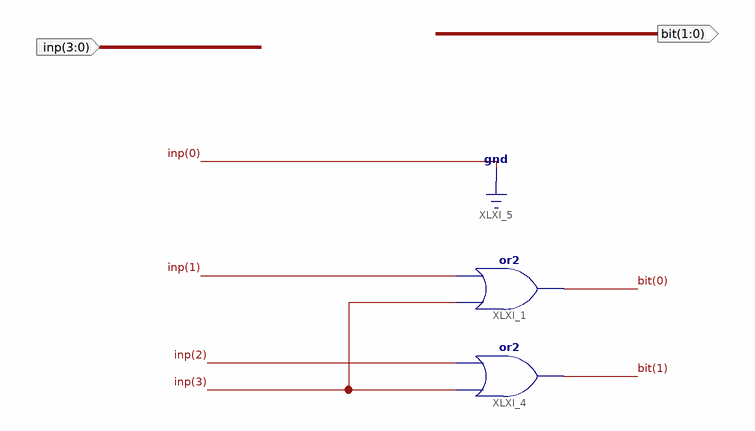
[diagram p0: schematic sheet 1]
// Xilinx ISE schematic EncodeGate.sch (spartan6) as structural Verilog: 2 symbols, 2 ports
module EncodeGate (
  input  [3:0] inp,
  output [1:0] \bit 
);

  or XLXI_1 (\bit [0], inp[3], inp[1]);
  or XLXI_4 (\bit [1], inp[3], inp[2]);
  // also tied to GND on the sheet: inp[0]
endmodule
